# Altium schematic sheet LEDs.SchDoc
size A4; SheetNumber: 11; SheetTotal: 11
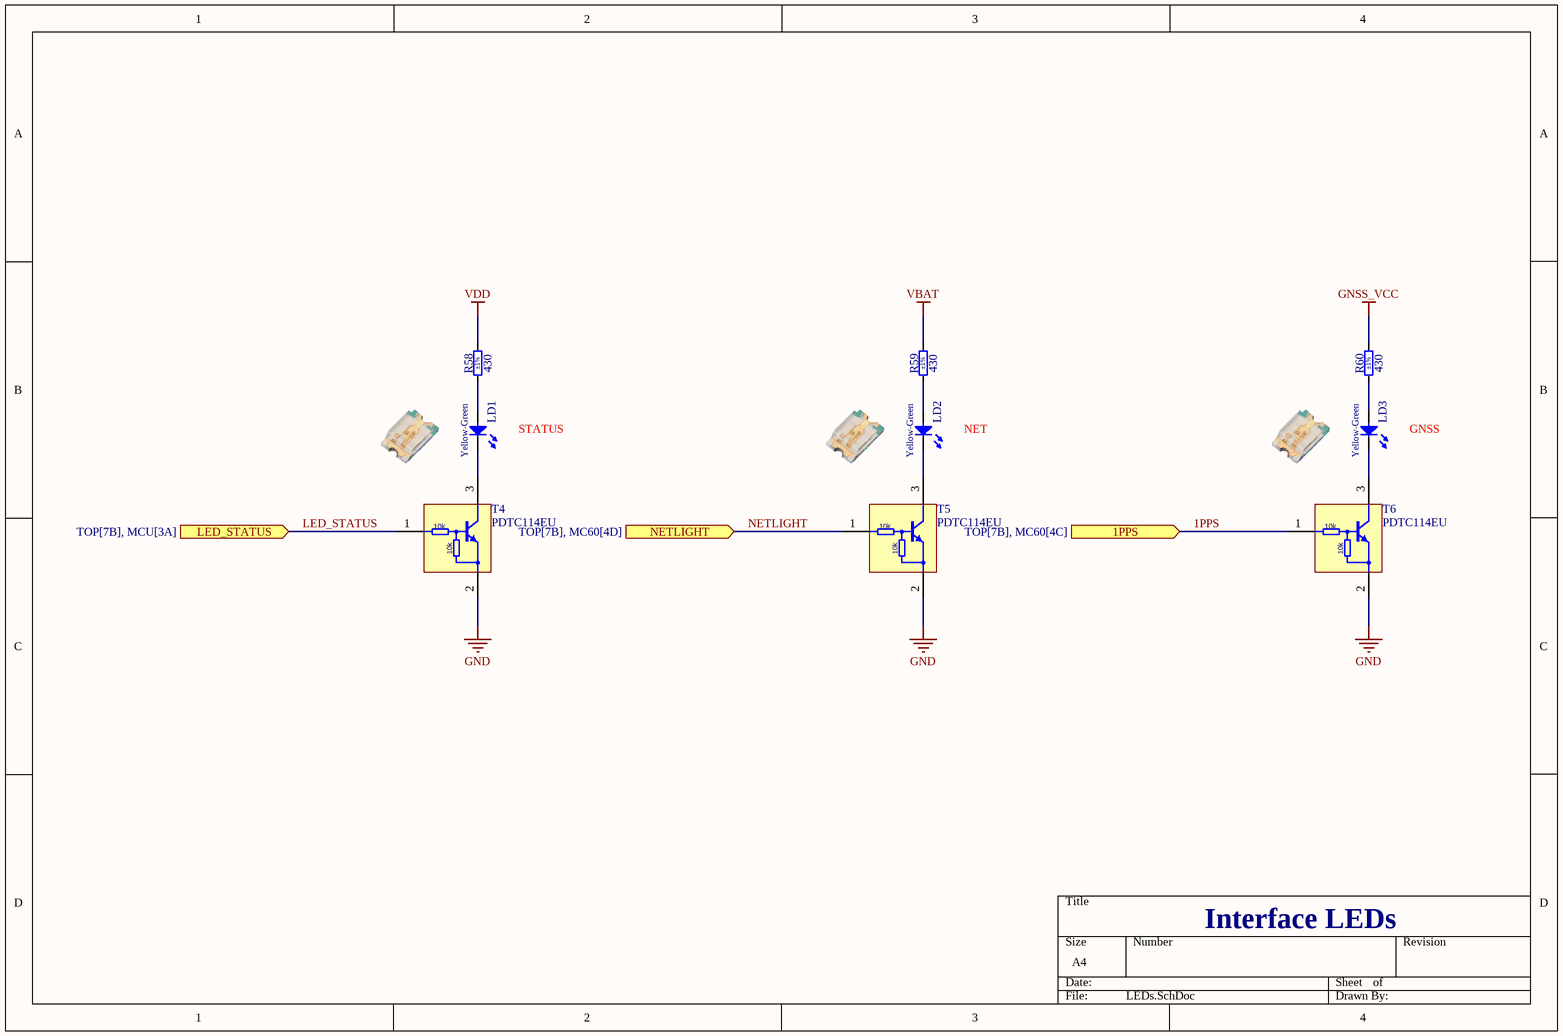
[diagram p0: LEDs.SchDoc]

## Parts
LD1  Yellow-Green  [LED_DIALIGHT_598-8060-107F]
LD2  Yellow-Green  [LED_DIALIGHT_598-8060-107F]
LD3  Yellow-Green  [LED_DIALIGHT_598-8060-107F]
R58  430  Tolerance: ±1%  [RESC1608X55N]
R59  430  Tolerance: ±1%  [RESC1608X55N]
R60  430  Tolerance: ±1%  [RESC1608X55N]
T4  PDTC114EU  [SOT65P210X100-3N]
T5  PDTC114EU  [SOT65P210X100-3N]
T6  PDTC114EU  [SOT65P210X100-3N]

## Ports
1PPS (in, see TOP[7B], MC60[4C]), LED_STATUS (in, see TOP[7B], MCU[3A]), NETLIGHT (in, see TOP[7B], MC60[4D])

## Nets
GND: T4.2(E) T5.2(E) T6.2(E)
GNSS_VCC: R60.2
VBAT: R59.2
VDD: R58.2
1PPS: T6.1(B) ; port 1PPS
LED_STATUS: T4.1(B) ; port LED_STATUS
NETLIGHT: T5.1(B) ; port NETLIGHT
NetLD1_1: LD1.1(C) T4.3(C)
NetLD1_2: LD1.2(A) R58.1
NetLD2_1: LD2.1(C) T5.3(C)
NetLD2_2: LD2.2(A) R59.1
NetLD3_1: LD3.1(C) T6.3(C)
NetLD3_2: LD3.2(A) R60.1

## Notes on the sheet
- STATUS
- NET
- GNSS
- Interface LEDs
- (in symbol PDTC114EU) 10k

## Library data of the parts
LD1-LD3 = LED_DIALIGHT_598-8060-107F: LED Yellow-Green 1C 2A; Part Description: Micro SMD Yellow-Green Led, 598 Series; PressFit: No; Bonding: No; Part Number: LED_DIALIGHT_598-8060-107F; Component Kind: Standard; Component Type: Standard; Color: Yellow-Green; PackageDescription: SMT Yellow-Green LED, Body 1.6x0.8mm, 0603 Case,  DIALIGHT 598 Series; Manufacturer: DIALIGHT; Manufacturer Part Number: 598-8060-107F; Pin Count: 2; Case: 0603; Mounted: Yes; Socket: No; SMD: Yes; Sense: No; ComponentHeight: 0.7mm; HelpURL: \\cern.ch\dfs\Applications\Altium\Datasheets\LED_DIALIGHT_598-8060-107F.pdf; Author: CERN DEM JLC; CreateDate: 13.02.2017; LatestRevisionDate: 13.02.2017
R58-R60 = R0603_430R_1%_0.1W_100PPM: Resistor - 1%; Part Description: General Purpose Thick Film Chip Resistor; Manufacturer: GENERIC; Manufacturer1 Part Number: NRC06F4300TRF; Power: 0.1W; TC: ±100ppm/°C; PressFit: No; Part Number: R0603_430R_1%_0.1W_100PPM; Component Kind: Standard; Component Type: Standard; Pin Count: 2; Value: 430; Status: Preferred; Manufacturer Part Number: R0603_430R_1%_0.1W_100PPM; Case: 0603; Mounted: Yes; Sense: No; Socket: No; SMD: Yes; Manufacturer1 Example: NIC COMPONENT; Manufacturer1 ComponentHeight: 0.55mm; HelpURL: \\cern.ch\dfs\Applications\Altium\Datasheets\R0603_NIC_NRC.pdf; Author: CERN DEM JLC; CreateDate: 03.12.2007; LatestRevisionDate: 13.03.2008
T4-T6 = PDTC114EU: Pre-Biased Bipolar Transistor (BJT) NPN - Pre-Biased 50 V 100 mA 200 mW Surface Mount SOT-323; Manufacturer: Nexperia USA Inc.; PressFit: No; Bonding: No; Part Number: PDTC114EU; Component Kind: Standard; Component Type: Standard; Device: PDTC114EU; PackageDescription: SOT323, 0.65mm pitch; 3 pin, 1.25mm W X 2.00mm L, IPC Medium Density; Part Description: Pre-Biased Bipolar Transistor (BJT) NPN - Pre-Biased 50 V 100 mA 200 mW Surface Mount SOT-323; Manufacturer Part Number: PDTC114EU; Pin Count: 3; Case: SOT-323; Mounted: Yes; Socket: No; SMD: Yes; Sense: No; ComponentHeight: 0.8mm; HelpURL: https://assets.nexperia.com/documents/data-sheet/PDTC114E_SER.pdf; Author: Xusniyor; CreateDate: 22.04.2023; LatestRevisionDate: 22.04.2023